# Altium schematic sheet PCard.SchDoc
size A
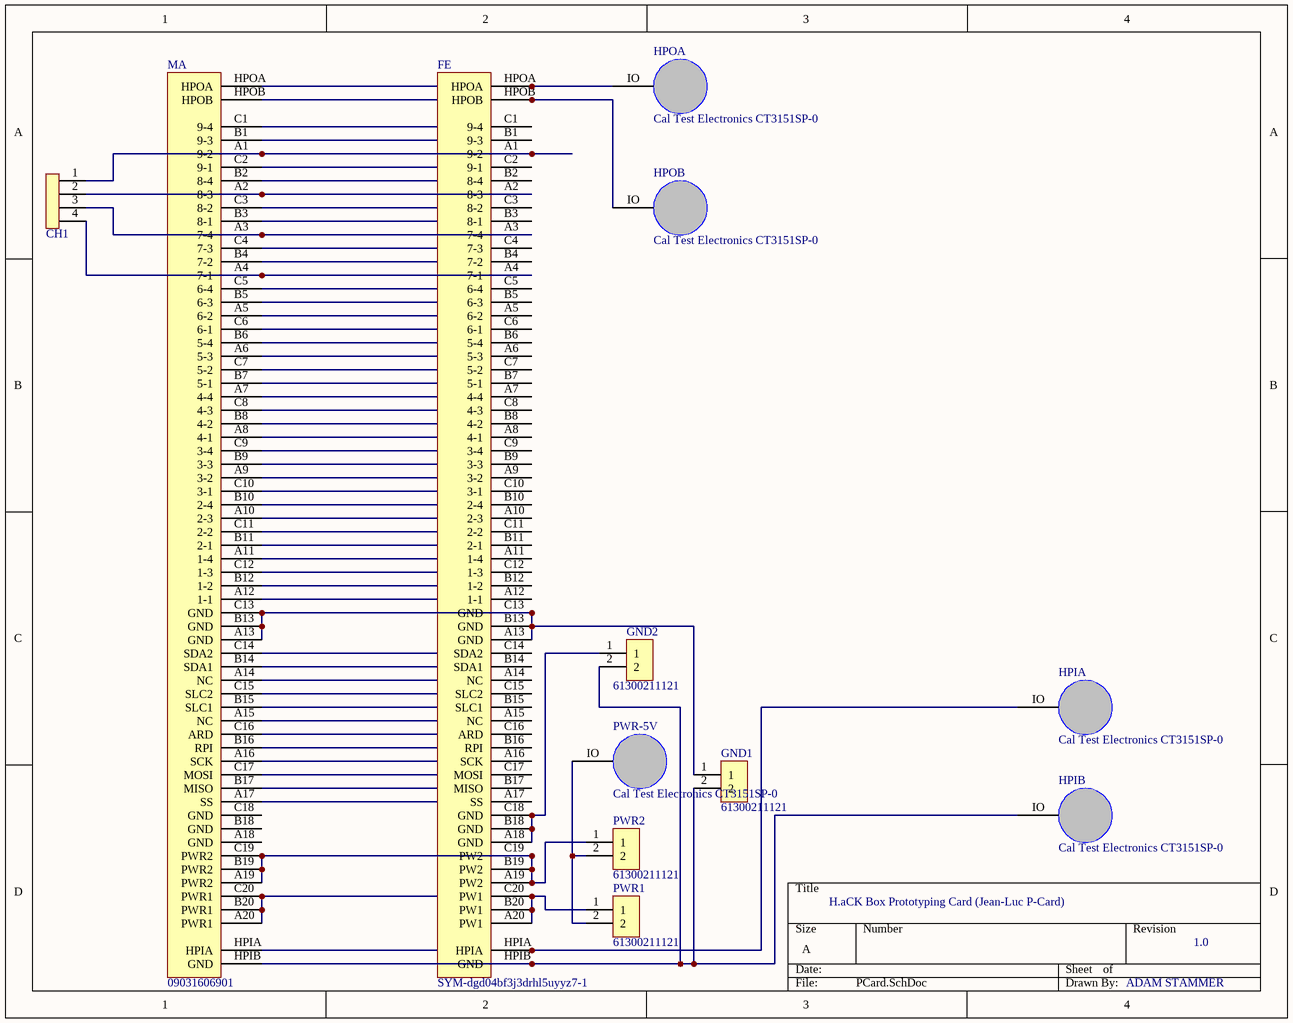
[diagram p0: PCard.SchDoc]

## Parts
CH1  Molex 22-28-4043  [HEADER_1x4]  (value not drawn)
FE  SYM-dgd04bf3j3drhl5uyyz7-1  [PCBComponent_1 - duplicate]
GND1  61300211121  [PCB-omgsbkhp90n7lpri88og-1]
GND2  61300211121  [PCB-omgsbkhp90n7lpri88og-1]
HPIA  Cal Test Electronics CT3151SP-0  [PCB-y1ci8m7vwvotsse2jq9i-1]
HPIB  Cal Test Electronics CT3151SP-0  [PCB-y1ci8m7vwvotsse2jq9i-1]
HPOA  Cal Test Electronics CT3151SP-0  [PCB-y1ci8m7vwvotsse2jq9i-1]
HPOB  Cal Test Electronics CT3151SP-0  [PCB-y1ci8m7vwvotsse2jq9i-1]
MA  09031606901  [PCB-uzhe8vs3bcqz6bzs18qy-1]
PWR1  61300211121  [PCB-omgsbkhp90n7lpri88og-1]
PWR2  61300211121  [PCB-omgsbkhp90n7lpri88og-1]
PWR-5V  Cal Test Electronics CT3151SP-0  [PCB-y1ci8m7vwvotsse2jq9i-1]

## Nets
NetCH1_1: CH1.1 FE.A1(9-2) MA.A1(9-2)
NetCH1_2: CH1.2 FE.A2(8-3) MA.A2(8-3)
NetCH1_3: CH1.3 FE.A3(7-4) MA.A3(7-4)
NetCH1_4: CH1.4 FE.A4(7-1) MA.A4(7-1)
NetFE_A5: FE.A5(6-2) MA.A5(6-2)
NetFE_A6: FE.A6(5-3) MA.A6(5-3)
NetFE_A7: FE.A7(4-4) MA.A7(4-4)
NetFE_A8: FE.A8(4-1) MA.A8(4-1)
NetFE_A9: FE.A9(3-2) MA.A9(3-2)
NetFE_A10: FE.A10(2-3) MA.A10(2-3)
NetFE_A11: FE.A11(1-4) MA.A11(1-4)
NetFE_A12: FE.A12(1-1) MA.A12(1-1)
NetFE_A13: FE.A13(GND) FE.B13(GND) FE.C13(GND) GND1.1 MA.A13(GND) MA.B13(GND) MA.C13(GND)
NetFE_A14: FE.A14(NC) MA.A14(NC)
NetFE_A15: FE.A15(NC) MA.A15(NC)
NetFE_A16: FE.A16(SCK) MA.A16(SCK)
NetFE_A17: FE.A17(SS) MA.A17(SS)
NetFE_A18: FE.A18(GND) FE.B18(GND) FE.C18(GND) GND2.1
NetFE_A19: FE.A19(PW2) FE.B19(PW2) FE.C19(PW2) MA.A19(PWR2) MA.B19(PWR2) MA.C19(PWR2) PWR2.1
NetFE_A20: FE.A20(PW1) FE.B20(PW1) FE.C20(PW1) MA.A20(PWR1) MA.B20(PWR1) MA.C20(PWR1) PWR1.1
NetFE_B1: FE.B1(9-3) MA.B1(9-3)
NetFE_B2: FE.B2(8-4) MA.B2(8-4)
NetFE_B3: FE.B3(8-1) MA.B3(8-1)
NetFE_B4: FE.B4(7-2) MA.B4(7-2)
NetFE_B5: FE.B5(6-3) MA.B5(6-3)
NetFE_B6: FE.B6(5-4) MA.B6(5-4)
NetFE_B7: FE.B7(5-1) MA.B7(5-1)
NetFE_B8: FE.B8(4-2) MA.B8(4-2)
NetFE_B9: FE.B9(3-3) MA.B9(3-3)
NetFE_B10: FE.B10(2-4) MA.B10(2-4)
NetFE_B11: FE.B11(2-1) MA.B11(2-1)
NetFE_B12: FE.B12(1-2) MA.B12(1-2)
NetFE_B14: FE.B14(SDA1) MA.B14(SDA1)
NetFE_B15: FE.B15(SLC1) MA.B15(SLC1)
NetFE_B16: FE.B16(RPI) MA.B16(RPI)
NetFE_B17: FE.B17(MISO) MA.B17(MISO)
NetFE_C1: FE.C1(9-4) MA.C1(9-4)
NetFE_C2: FE.C2(9-1) MA.C2(9-1)
NetFE_C3: FE.C3(8-2) MA.C3(8-2)
NetFE_C4: FE.C4(7-3) MA.C4(7-3)
NetFE_C5: FE.C5(6-4) MA.C5(6-4)
NetFE_C6: FE.C6(6-1) MA.C6(6-1)
NetFE_C7: FE.C7(5-2) MA.C7(5-2)
NetFE_C8: FE.C8(4-3) MA.C8(4-3)
NetFE_C9: FE.C9(3-4) MA.C9(3-4)
NetFE_C10: FE.C10(3-1) MA.C10(3-1)
NetFE_C11: FE.C11(2-2) MA.C11(2-2)
NetFE_C12: FE.C12(1-3) MA.C12(1-3)
NetFE_C14: FE.C14(SDA2) MA.C14(SDA2)
NetFE_C15: FE.C15(SLC2) MA.C15(SLC2)
NetFE_C16: FE.C16(ARD) MA.C16(ARD)
NetFE_C17: FE.C17(MOSI) MA.C17(MOSI)
NetFE_HPIA: FE.HPIA HPIA.IO MA.HPIA
NetFE_HPIB: FE.HPIB(GND) GND1.2 GND2.2 HPIB.IO MA.HPIB(GND)
NetFE_HPOA: FE.HPOA HPOA.IO MA.HPOA
NetFE_HPOB: FE.HPOB HPOB.IO MA.HPOB
NetPWR1_2: PWR1.2 PWR2.2 PWR-5V.IO

Not connected (* = marked no-connect by the designer): MA A18(GND) B18(GND) C18(GND)

## Notes on the sheet
- H.aCK Box Prototyping Card (Jean-Luc P-Card)
- 1.0
- ADAM STAMMER

## Library data of the parts
CH1 = CMP-44448d4a5f9d9b83-3: Conn; Rect./PCB; Breakaway Header; 4 Cir.; Vert.; KK 254 Ser.; Gold Plate; 6.09mm Pin L; Current Rating: 4.00 A; Voltage Rating (DC): 250 V; Gender: Male; Lead-Free Status: Lead Free; Number of Circuits: 4; Pin Pitch: 2.54 mm; Glow Wire Compliant: Non-Compliant; RoHS: Compliant; REACH SVHC Compliance: No SVHC; Color: Black; Number of Rows: 1; Lifecycle Status: Active; Contact Material: Phosphor Bronze; Orientation: Vertical; Mounting Style: Through Hole; Size-Length: 10.2 mm; Size-Width: 2.49 mm; Packaging: Bulk; Manufacturer Part Number: 22-28-4043; Size-Height: 2.29 mm; Octopart URL: https://octopart.com/22-28-4043-molex-278207; Number of Contacts: 4; Housing Color: Black; Housing Material: Nylon; Flammability Rating: UL 94 V-0; Halogen Free Status: Not Low Halogen; Operating Temperature: 75.0 °C (max)
FE = CMP-dgd04bf3j3drhl5uyyz7-22: CONN DIN RCPT 64POS PCB GOLD; CustomComponentID: dgd04bf3j3drhl5uyyz7
GND1 GND2 PWR1 PWR2 = CMP-748fbcb73d6bab48-27: THT Vertical Pin Header WR-PHD, Pitch 2.54 mm, Single Row, 2 pins; Contact Resistance: 20.0 mΩ; Number of Contacts: 2; Dielectric Withstanding Voltage: 500 V; Current Rating: 3.00 A; Lead-Free Status: Lead Free; Operating Voltage: 250 V; Gender: Male; OctopartID: 748fbcb73d6bab48; Orientation: Vertical; Number of Pins: 2; RoHS: Compliant; Contact Plating: Gold; Operating Temperature: -40.0 °C (min); Manufacturer Part Number: 61300211121; Contact Material: Copper; REACH SVHC Compliance: No SVHC; Mounting Style: Through Hole; Packaging: Bag
HPIA HPIB HPOA HPOB PWR-5V = CMP-869a4c9259de595d-9: 4MM Safety Jack , Horizontal Pcb Mount Black; Octopart URL: https://octopart.com/ct3151sp-0-cal+test+electronics-50526754
MA = CMP-dd70146577e902b7-11: Conn DIN 41612 M 60Power/4Coaxial POS 2.54mm Solder RA Thru-Hole; Octopart URL: https://octopart.com/09031606901-harting+elektronik-2068479; Mounting Style: Through Hole, PC Board, Solder; RoHS: Compliant; Number of Rows: 3